# Altium schematic sheet MAIN.SchDoc: =DocumentName
size A4; CompanyName: "AS Manufacturing" LLC; Organization: "AS Manufacturing" LLC; Address1: 5 Sklyarenka St.; Address2: Kyiv 04073; Address3: Ukraine; Address4: https://ajax.systems/en/; DocumentNumber: 1; SheetNumber: 1; SheetTotal: 7; Template_version: 1.0.1
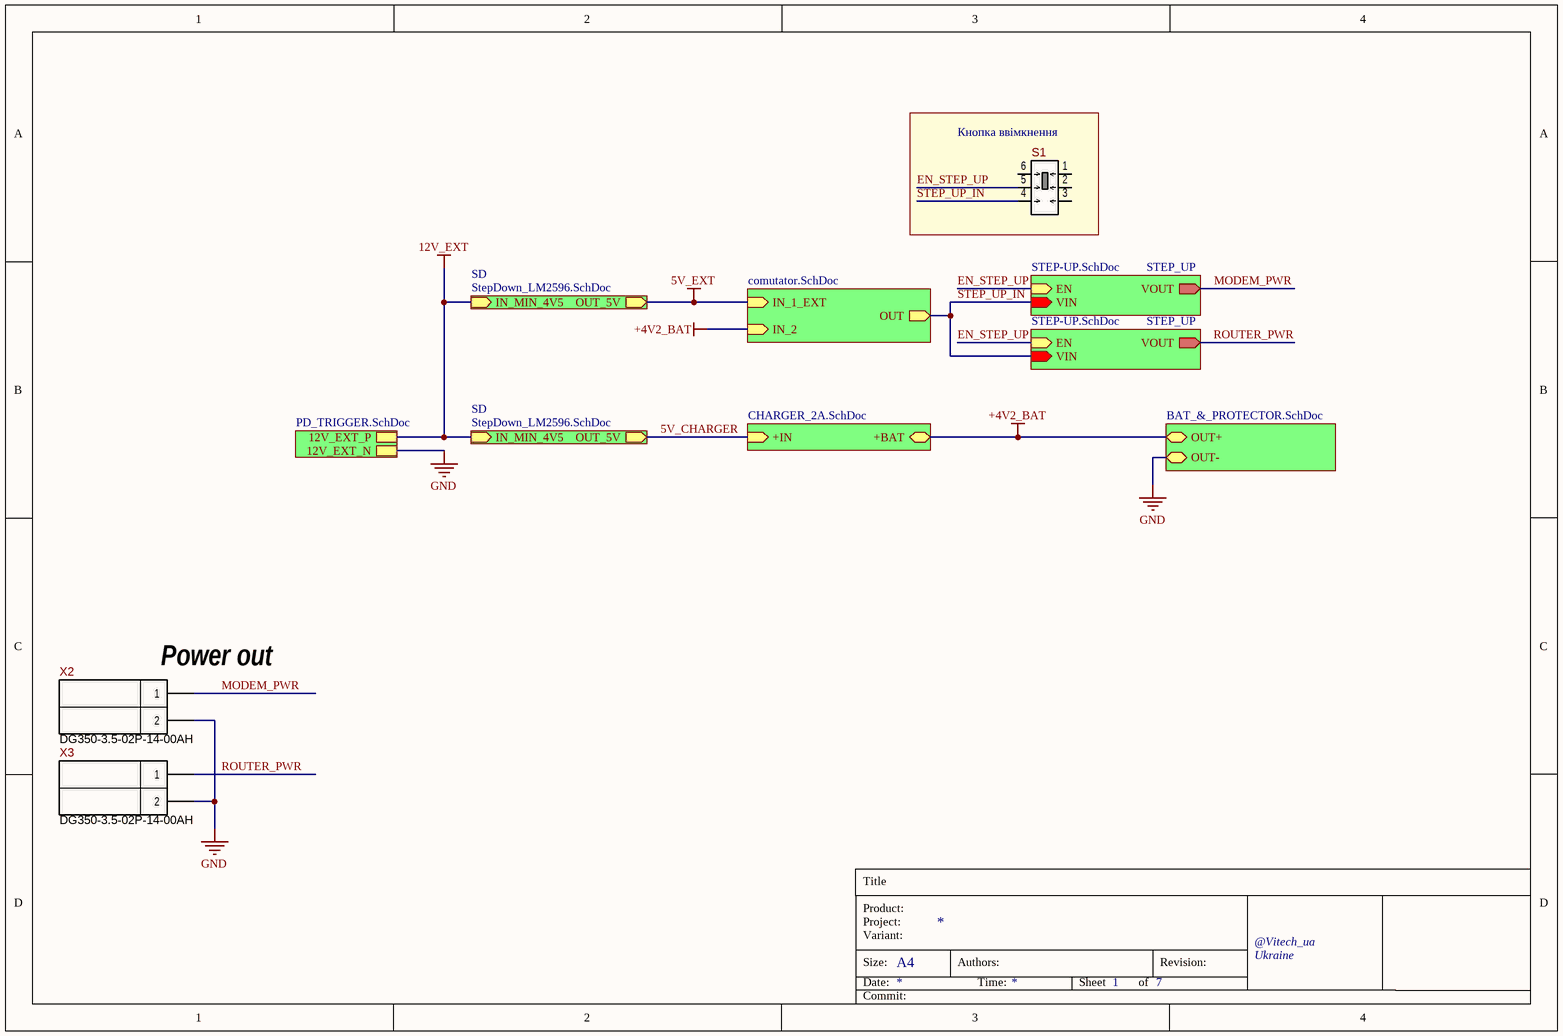
[diagram p0: MAIN.SchDoc]

## Parts
S1  SK22N13U02-2000  [SK22N13U02-2000]  (value not drawn)
X2  DG350-3.5-02P  [DG350-3.5-02P-14-00AH]  (value not drawn)
X3  DG350-3.5-02P  [DG350-3.5-02P-14-00AH]  (value not drawn)

## Blocks framed on the sheet
Кнопка ввімкнення: S1

## Sub-sheets
charger = CHARGER_2A.SchDoc: +BAT (bidir), +IN (in)
COMUTATOR = comutator.SchDoc: IN_1_EXT (in), IN_2 (in), OUT (out)
Designator = PD_TRIGGER.SchDoc: 12V_EXT_P, 12V_EXT_N
pROTECTOR = BAT_&_PROTECTOR.SchDoc: OUT+ (bidir), OUT- (bidir)
SD = StepDown_LM2596.SchDoc: IN_MIN_4V5 (in), OUT_5V (out)
SD = StepDown_LM2596.SchDoc: IN_MIN_4V5 (in), OUT_5V (out)
STEP_UP = STEP-UP.SchDoc: VIN (in), VOUT (out), EN (in)
STEP_UP = STEP-UP.SchDoc: VIN (in), VOUT (out), EN (in)

## Nets
5V_EXT: sheet COMUTATOR/IN_1_EXT, sheet SD/OUT_5V
12V_EXT: sheet Designator/12V_EXT_P, sheet SD/IN_MIN_4V5, sheet SD/IN_MIN_4V5
+4V2_BAT: sheet charger/+BAT, sheet COMUTATOR/IN_2, sheet pROTECTOR/OUT+
GND: X2.2 X3.2 ; sheet pROTECTOR/OUT-, sheet Designator/12V_EXT_N
5V_CHARGER: sheet charger/+IN, sheet SD/OUT_5V
EN_STEP_UP: S1.5 ; sheet STEP_UP/EN, sheet STEP_UP/EN
MODEM_PWR: X2.1 ; sheet STEP_UP/VOUT
ROUTER_PWR: X3.1 ; sheet STEP_UP/VOUT
STEP_UP_IN: S1.4 ; sheet STEP_UP/VIN, sheet COMUTATOR/OUT, sheet STEP_UP/VIN

Not connected (* = marked no-connect by the designer): S1 1 2 3 6

## Notes on the sheet
- (near X2) Power out
- Title
- Product:
- Project:
- Size:
- Date:
- Variant:
- A4
- Authors:
- Time:
- Sheet
- of
- Revision:
- @Vitech_ua
- Commit:

## Library data of the parts
S1 = SK22N13U02-2000: DPDT Switch, 10.4х6х5mm, Knob Length 2 mm; Manufacturer: Sun Rise Electronic; Ajax_1C_ID: 1220; Ajax_1C_PN: SK22N13U02-2000, выключатель; Ajax_1С_Status: Mass Production; Component Status: Released; Replacement: NONE; GUID_1C: 10be1646-dd40-11e0-af93-6c626deda1bb; Part Number: SK22N13U02-2000; Part Type: Switch; Component Type: PTH; Temperature Range: NONE; ComponentLink1URL: \\altiumdb.ajax.local\files\Datasheet\Electromechanics\SK22N13U.pdf; Price: 0.05; ComponentLink1Description: Datasheet
X2 X3 = DG350-3.5-02P-14-00AH: Screw Terminal, 3.5mm Pitch, 2 pin, Green; Manufacturer: Degson; Ajax_1C_ID: 21524; Ajax_1C_PN: DG350-3.5-02P-14-00AH, клеммник; Ajax_1С_Status: RND Only; Component Status: Released; Replacement: NONE; GUID_1C: 367ff815-d639-11ea-ab63-0050569f2651; Part Number: DG350-3.5-02P-14-00AH; Part Type: Terminal; Component Type: PTH; Temperature Range: -40°C ~ 105°C; ComponentLink1URL: \\altiumdb.ajax.local\files\Datasheet\Connectors\DG350-3.5,3.96.pdf; Price: 0,17091154; ComponentLink1Description: Datasheet